# Altium schematic sheet p4b-leds.SchDoc
size A; PageSetup: Record=PageOptions|CenterHorizontal=True|CenterVertical=True|PrintScale=1.11|XCorrection=1.00|YCorrection=1.00|PrintKind=0|BorderSize=5000000|LeftOffset=0|BottomOffset=0|Orientation=2|PaperLength=1000|PaperWidth=1000|Scale=100|PaperSource=7|PrintQuality=-3|MediaType=1|DitherType=10|PrintScaleMode=1|PaperKind=Letter|PaperIndex=1
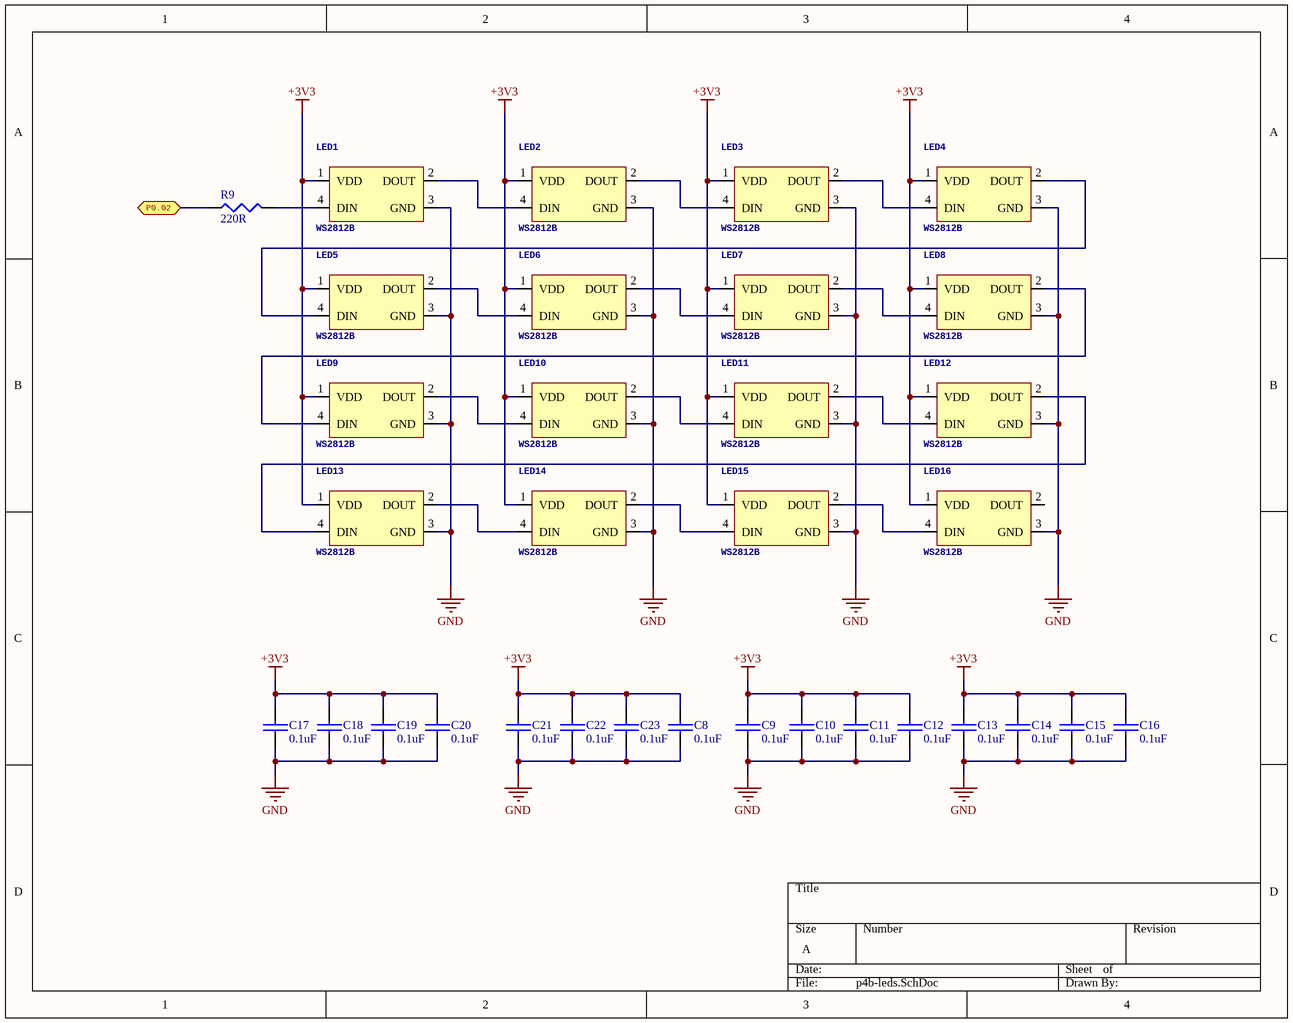
[diagram p0: p4b-leds.SchDoc]

## Parts
C8  value 0.1uF  [C0603]  (hidden comment: VALUE)
C9  value 0.1uF  [C0603]  (hidden comment: VALUE)
C10  value 0.1uF  [C0603]  (hidden comment: VALUE)
C11  value 0.1uF  [C0603]  (hidden comment: VALUE)
C12  value 0.1uF  [C0603]  (hidden comment: VALUE)
C13  value 0.1uF  [C0603]  (hidden comment: VALUE)
C14  value 0.1uF  [C0603]  (hidden comment: VALUE)
C15  value 0.1uF  [C0603]  (hidden comment: VALUE)
C16  value 0.1uF  [C0603]  (hidden comment: VALUE)
C17  value 0.1uF  [C0603]  (hidden comment: VALUE)
C18  value 0.1uF  [C0603]  (hidden comment: VALUE)
C19  value 0.1uF  [C0603]  (hidden comment: VALUE)
C20  value 0.1uF  [C0603]  (hidden comment: VALUE)
C21  value 0.1uF  [C0603]  (hidden comment: VALUE)
C22  value 0.1uF  [C0603]  (hidden comment: VALUE)
C23  value 0.1uF  [C0603]  (hidden comment: VALUE)
LED1  WS2812B  [WS2812B]
LED2  WS2812B  [WS2812B]
LED3  WS2812B  [WS2812B]
LED4  WS2812B  [WS2812B]
LED5  WS2812B  [WS2812B]
LED6  WS2812B  [WS2812B]
LED7  WS2812B  [WS2812B]
LED8  WS2812B  [WS2812B]
LED9  WS2812B  [WS2812B]
LED10  WS2812B  [WS2812B]
LED11  WS2812B  [WS2812B]
LED12  WS2812B  [WS2812B]
LED13  WS2812B  [WS2812B]
LED14  WS2812B  [WS2812B]
LED15  WS2812B  [WS2812B]
LED16  WS2812B  [WS2812B]
R9  220R  [R0603]

## Ports
P0.02

## Nets
+3V3: C8.1(A) C9.1(A) C10.1(A) C11.1(A) C12.1(A) C13.1(A) C14.1(A) C15.1(A) C16.1(A) C17.1(A) C18.1(A) C19.1(A) C20.1(A) C21.1(A) C22.1(A) C23.1(A) LED1.1(VDD) LED2.1(VDD) LED3.1(VDD) LED4.1(VDD) LED5.1(VDD) LED6.1(VDD) LED7.1(VDD) LED8.1(VDD) LED9.1(VDD) LED10.1(VDD) LED11.1(VDD) LED12.1(VDD) LED13.1(VDD) LED14.1(VDD) LED15.1(VDD) LED16.1(VDD)
GND: C8.2(B) C9.2(B) C10.2(B) C11.2(B) C12.2(B) C13.2(B) C14.2(B) C15.2(B) C16.2(B) C17.2(B) C18.2(B) C19.2(B) C20.2(B) C21.2(B) C22.2(B) C23.2(B) LED1.3(GND) LED2.3(GND) LED3.3(GND) LED4.3(GND) LED5.3(GND) LED6.3(GND) LED7.3(GND) LED8.3(GND) LED9.3(GND) LED10.3(GND) LED11.3(GND) LED12.3(GND) LED13.3(GND) LED14.3(GND) LED15.3(GND) LED16.3(GND)
P0.02: R9.1(A) ; port P0.02
NetLED1_2: LED1.2(DOUT) LED2.4(DIN)
NetLED1_4: LED1.4(DIN) R9.2(B)
NetLED2_2: LED2.2(DOUT) LED3.4(DIN)
NetLED3_2: LED3.2(DOUT) LED4.4(DIN)
NetLED4_2: LED4.2(DOUT) LED5.4(DIN)
NetLED5_2: LED5.2(DOUT) LED6.4(DIN)
NetLED6_2: LED6.2(DOUT) LED7.4(DIN)
NetLED7_2: LED7.2(DOUT) LED8.4(DIN)
NetLED8_2: LED8.2(DOUT) LED9.4(DIN)
NetLED9_2: LED9.2(DOUT) LED10.4(DIN)
NetLED10_2: LED10.2(DOUT) LED11.4(DIN)
NetLED11_2: LED11.2(DOUT) LED12.4(DIN)
NetLED12_2: LED12.2(DOUT) LED13.4(DIN)
NetLED13_2: LED13.2(DOUT) LED14.4(DIN)
NetLED14_2: LED14.2(DOUT) LED15.4(DIN)
NetLED15_2: LED15.2(DOUT) LED16.4(DIN)

Not connected (* = marked no-connect by the designer): LED16 2(DOUT)

## Library data of the parts
C8-C23 = CAP-0.1UF-0603: CAP, CER, 0.1UF, 6.3v, 10%, X5R, 0603
LED1-LED16 = WS2812B: WS2812B RGB LED; VENDOR: BTF-lighting; VALUE: WS2812B; MFG_PN: WS2812B; VENDOR_PN: WS2812B; VENDOR_LINK: https://www.aliexpress.com/store/product/10-1000pcs-WS2812B-4pins-5050-SMD-Black-White-version-WS2812-Individually-Addressable-Digital-RGB-LED-Chip/1051119_32453497583.html?spm=2114.12010608.0.0.75ad4df1qQP28f
R9 = RES-47-0603: RES, 220 OHM, 1/10W, 5%, 0603 SMD; VALUE: 220R